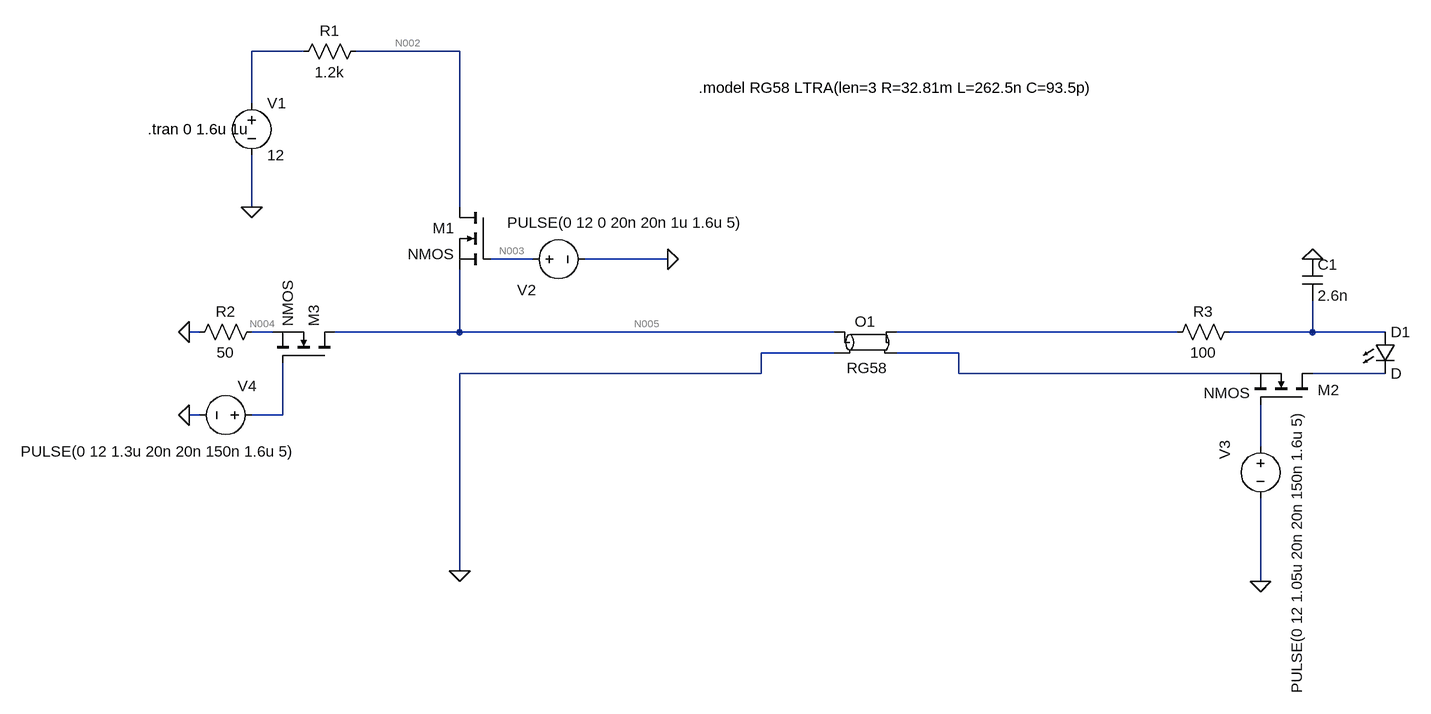
[diagram p0: schematic LEDpulser4_RG58_external timer.asc]
LEDpulser4_RG58_external timer.asc, the LTspice schematic file:
Version 4
SHEET 1 1164 860
WIRE -560 -160 -640 -160
WIRE -320 -160 -480 -160
WIRE -640 -80 -640 -160
WIRE -640 80 -640 0
WIRE -320 80 -320 -160
WIRE -208 160 -272 160
WIRE 0 160 -128 160
WIRE -720 272 -736 272
WIRE -608 272 -640 272
WIRE -320 272 -320 176
WIRE -320 272 -512 272
WIRE 256 272 -320 272
WIRE 784 272 352 272
WIRE 992 272 992 224
WIRE 992 272 864 272
WIRE 1104 272 992 272
WIRE 256 304 144 304
WIRE 448 304 352 304
WIRE 144 336 144 304
WIRE 144 336 -320 336
WIRE 448 336 448 304
WIRE 896 336 448 336
WIRE 1104 336 992 336
WIRE -720 400 -736 400
WIRE -592 400 -592 320
WIRE -592 400 -640 400
WIRE 912 448 912 384
WIRE -320 640 -320 336
WIRE 912 656 912 528
FLAG 0 160 0
FLAG -640 80 0
FLAG 912 656 0
FLAG -736 400 0
FLAG -736 272 0
FLAG 992 160 0
FLAG -320 640 0
SYMBOL voltage -640 -96 R0
WINDOW 123 0 0 Left 0
WINDOW 39 0 0 Left 0
SYMATTR InstName V1
SYMATTR Value 12
SYMBOL voltage -224 160 R270
WINDOW 0 -63 7 VTop 2
WINDOW 3 72 159 VBottom 2
WINDOW 123 0 0 Left 0
WINDOW 39 0 0 Left 0
SYMATTR InstName V2
SYMATTR Value PULSE(0 12 0 20n 20n 1u 1.6u 5)
SYMBOL nmos -272 80 M0
SYMATTR InstName M1
SYMBOL res -464 -176 R90
WINDOW 0 0 56 VBottom 2
WINDOW 3 32 56 VTop 2
SYMATTR InstName R1
SYMATTR Value 1.2k
SYMBOL nmos 992 384 M270
WINDOW 0 23 -8 VLeft 2
WINDOW 3 18 167 VLeft 2
SYMATTR InstName M2
SYMBOL voltage 912 432 R0
WINDOW 0 -55 7 VRight 2
WINDOW 3 56 -42 VRight 2
WINDOW 123 0 0 Left 0
WINDOW 39 0 0 Left 0
SYMATTR InstName V3
SYMATTR Value PULSE(0 12 1.05u 20n 20n 150n 1.6u 5)
SYMBOL nmos -512 320 M270
SYMATTR InstName M3
SYMBOL res -736 288 R270
WINDOW 0 32 56 VTop 2
WINDOW 3 0 56 VBottom 2
SYMATTR InstName R2
SYMATTR Value 50
SYMBOL voltage -624 400 R90
WINDOW 0 -45 8 VRight 2
WINDOW 3 56 -54 VRight 2
WINDOW 123 0 0 Left 0
WINDOW 39 0 0 Left 0
SYMATTR InstName V4
SYMATTR Value PULSE(0 12 1.3u 20n 20n 150n 1.6u 5)
SYMBOL LED 1088 272 R0
SYMATTR InstName D1
SYMBOL cap 976 160 R0
SYMATTR InstName C1
SYMATTR Value 2.6n
SYMBOL res 880 256 R90
WINDOW 0 0 56 VBottom 2
WINDOW 3 32 56 VTop 2
SYMATTR InstName R3
SYMATTR Value 100
SYMBOL ltline 304 288 R0
WINDOW 3 3 24 Top 2
SYMATTR Value RG58
SYMATTR InstName O1
TEXT -800 -40 Left 2 !.tran 0 1.6u 1u
TEXT 48 -104 Left 2 !.model RG58 LTRA(len=3 R=32.81m L=262.5n C=93.5p)

The netlist it stands for:
* LEDpulser4_RG58_external timer.asc
V1 N001 0 12
V2 N003 0 PULSE(0 12 0 20n 20n 1u 1.6u 5)
M1 N002 N003 N005 N005 NMOS
R1 N002 N001 1.2k
M2 N009 N011 N008 N008 NMOS
V3 N011 0 PULSE(0 12 1.05u 20n 20n 150n 1.6u 5)
M3 N005 N010 N004 N004 NMOS
R2 0 N004 50
V4 N010 0 PULSE(0 12 1.3u 20n 20n 150n 1.6u 5)
D1 N007 N009 D
C1 0 N007 2.6n
R3 N007 N006 100
O1 N005 0 N006 N008 RG58
.model D D
.lib standard.dio
.model NMOS NMOS
.model PMOS PMOS
.lib standard.mos
.tran 0 1.6u 1u
.model RG58 LTRA(len=3 R=32.81m L=262.5n C=93.5p)
.backanno
.end

* Results of the author's LTspice run, read from the files saved beside the schematic
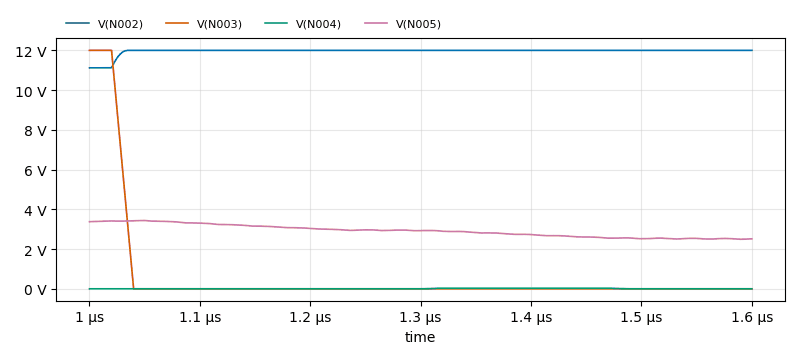
[diagram p1: Transient Analysis of LEDpulser4_RG58_external timer.asc, plotted from the saved traces]
* Transient Analysis, 1 run:
*   V(N002): min 11.12 V, max 12 V, average 11.96 V, rms 11.96 V, last 12 V
*   V(N003): min 0 V, max 12 V, average 600 mV, rms 2.531 V, last 0 V
*   V(N004): min 0 V, max 30.19 mV, average 8.035 mV, rms 14.94 mV, last 0 V
*   V(N005): min 2.493 V, max 3.437 V, average 2.915 V, rms 2.931 V, last 2.517 V